# Altium schematic sheet ИУ4.11.03.03.20.63.13.SchDoc
size 420 x 297 mm; PageSetup: Record=PageOptions|CenterHorizontal=True|CenterVertical=True|PrintScale=1.00|XCorrection=1.00|YCorrection=1.00|PrintKind=1|BorderSize=5000000|LeftOffset=0|BottomOffset=0|Orientation=2|PaperLength=1000|PaperWidth=1000|Scale=100|PaperSource=15|PrintQuality=1200|MediaType=1|DitherType=10|PaperKind=A3|PrintScaleMode=1; Weight: -; ScaleFactor: -; Address1: Address1; Address2: Address2; Address3: Address3; Address4: Address4; DocumentNumber: АБВГ.123456.001 Э3; SheetNumber: 1; Scale: 1:1; DocumentType: Схема электрическая принципиальная; FirstReferrence: АБВГ.123456.001
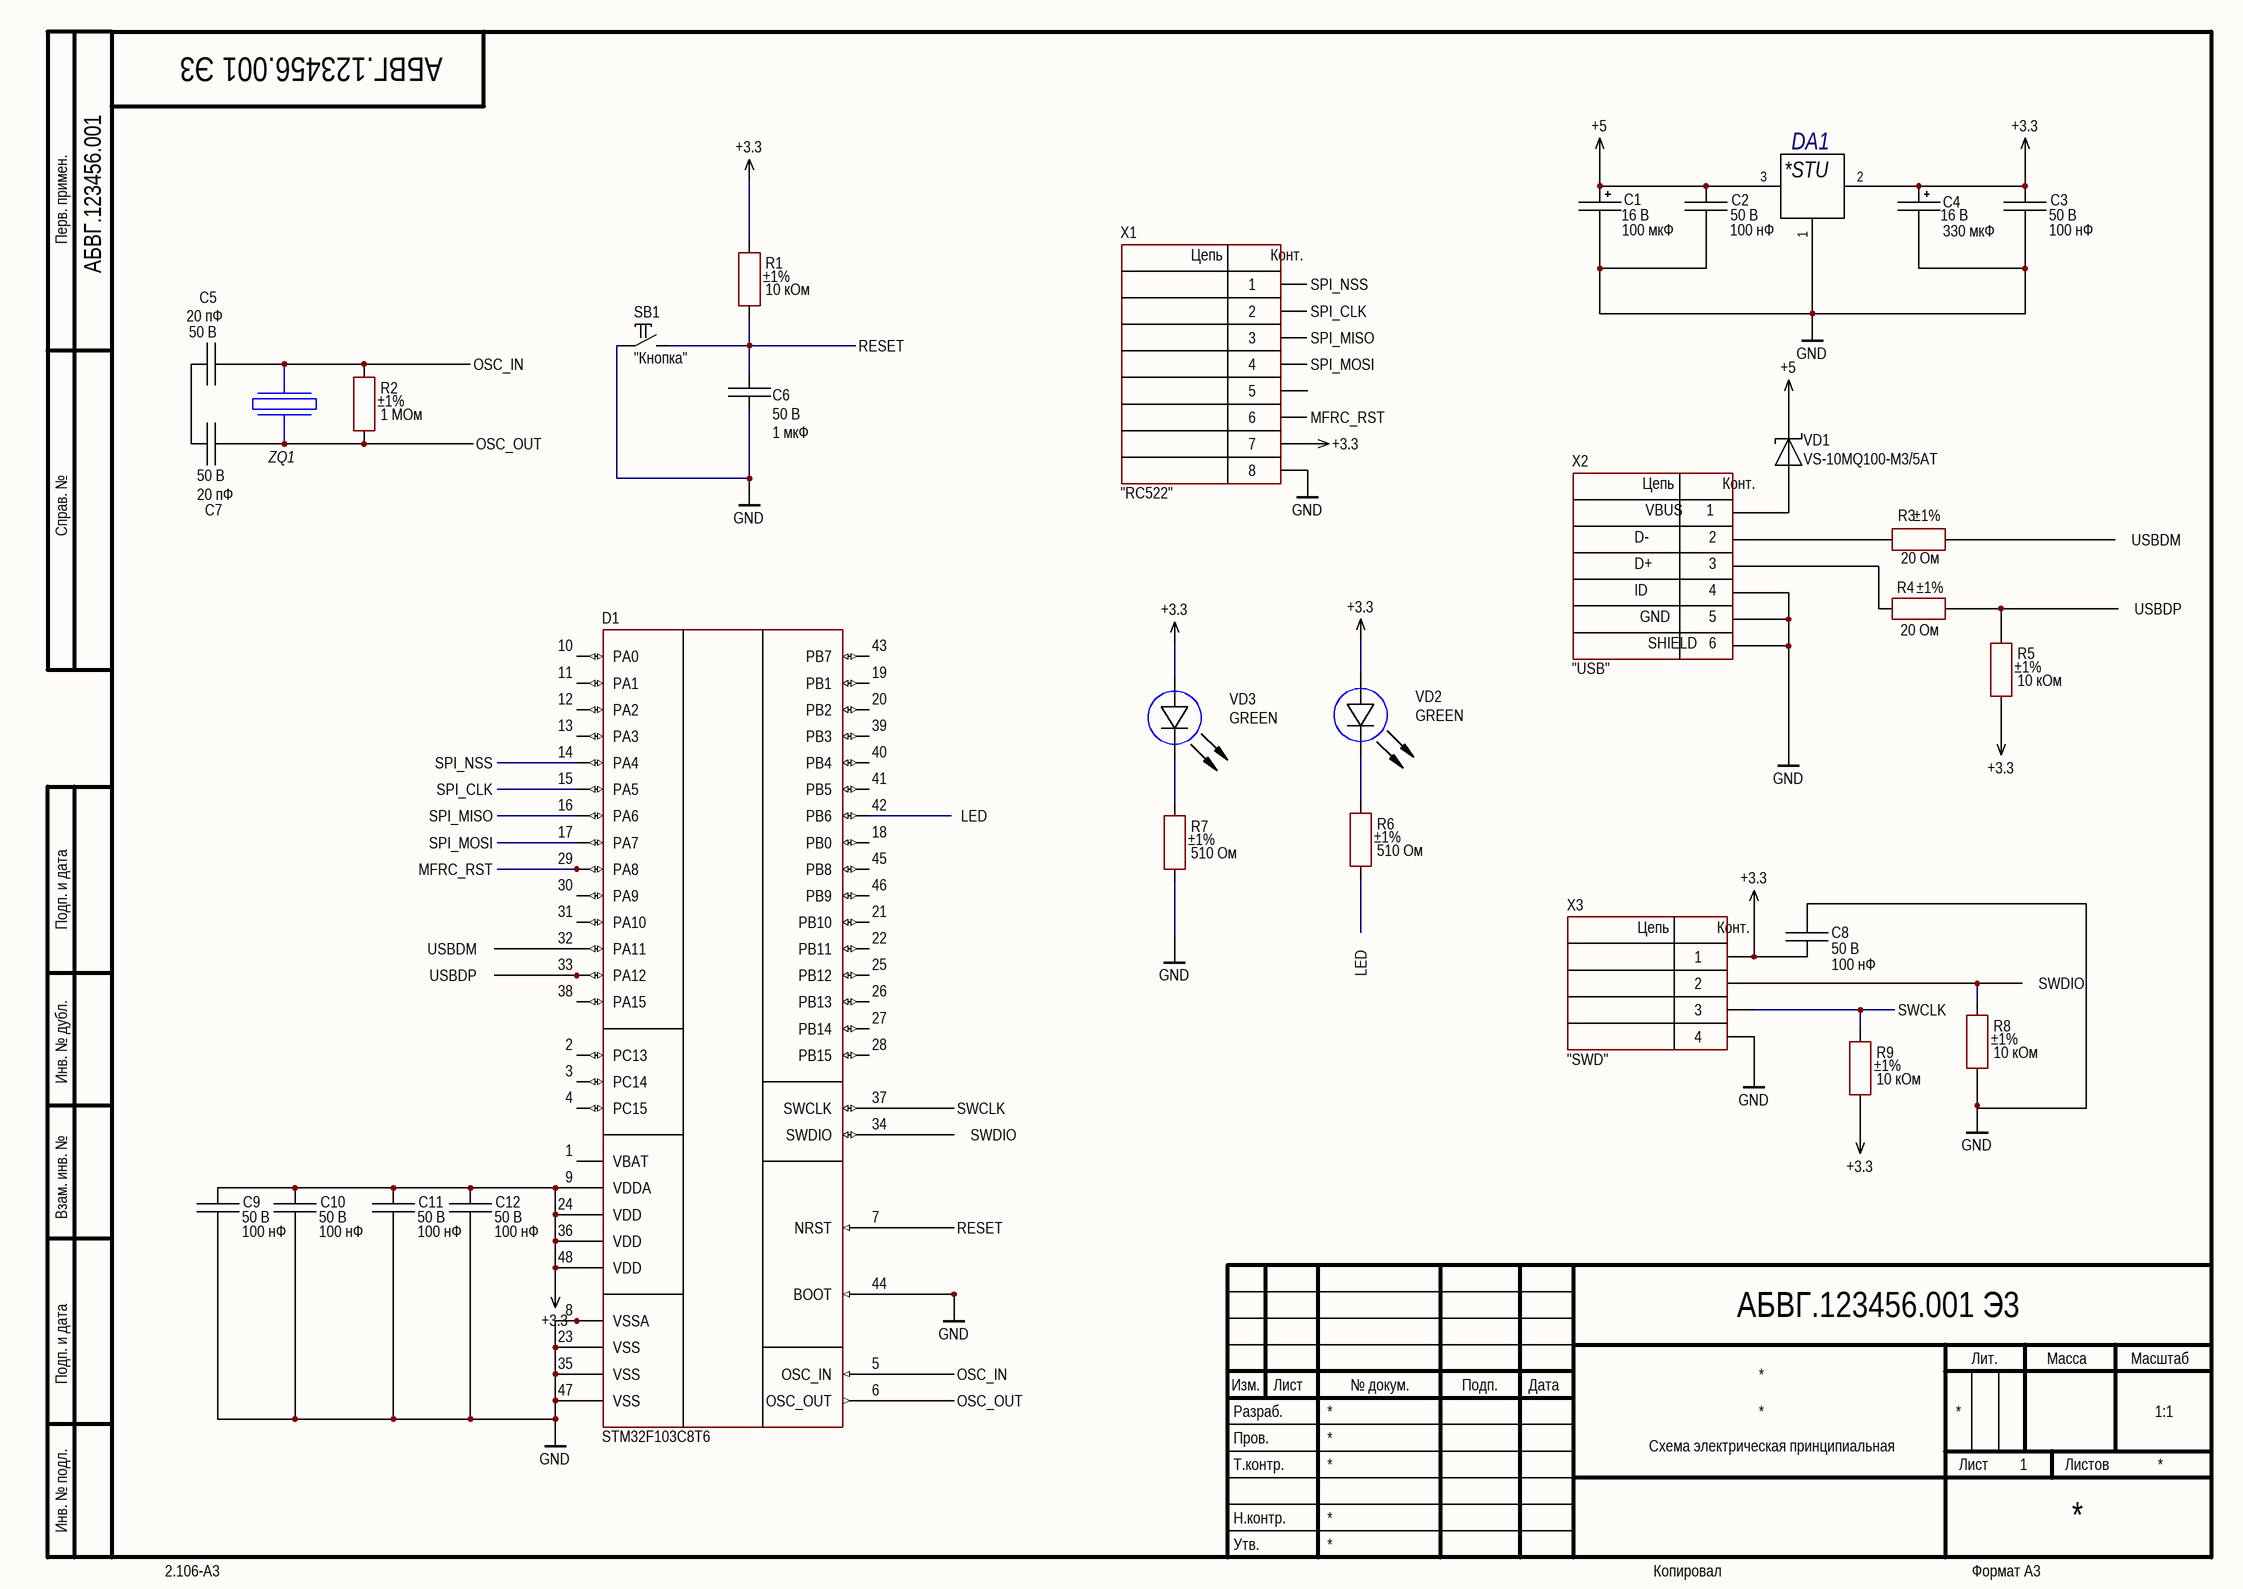
[diagram p0: ИУ4.11.03.03.20.63.13.SchDoc]

## Parts
C1  value 100 мкФ  Voltage: 16 В  [CAP: TANTAL-D]
C2  value 100 нФ  Voltage: 50 В  [CAP: 0805]
C3  value 100 нФ  Voltage: 50 В  [CAP: 0805]
C4  value 330 мкФ  Voltage: 16 В  [CAP: D8C3.5H12]
C5  value 20 пФ  Voltage: 50 В  [CAP: 0805]
C6  value 1 мкФ  Voltage: 50 В  [CAP: 0805]
C7  value 20 пФ  Voltage: 50 В  [CAP: 0805]
C8  value 100 нФ  Voltage: 50 В  [CAP: 0805]
C9  value 100 нФ  Voltage: 50 В  [CAP: 0805]
C10  value 100 нФ  Voltage: 50 В  [CAP: 0805]
C11  value 100 нФ  Voltage: 50 В  [CAP: 0805]
C12  value 100 нФ  Voltage: 50 В  [CAP: 0805]
D1  (no value)  [48-LQFP]
DA1  LM1117-Series  [SOT-223]  (value not drawn)
R1  value 10 кОм  Tolerance: ±1%  [RES: 0805]
R2  value 1 МОм  Tolerance: ±1%  [RES: 0805]
R3  value 20 Ом  Tolerance: ±1%  [RES: 0805]
R4  value 20 Ом  Tolerance: ±1%  [RES: 0805]
R5  value 10 кОм  Tolerance: ±1%  [RES: 0805]
R6  value 510 Ом  Tolerance: ±1%  [RES: 0805]
R7  value 510 Ом  Tolerance: ±1%  [RES: 0805]
R8  value 10 кОм  Tolerance: ±1%  [RES: 0805]
R9  value 10 кОм  Tolerance: ±1%  [RES: 0805]
SB1  CommentText: "Кнопка"  [BUT: 6x6 SMD]
VD1  PartNumber: VS-10MQ100-M3/5AT  [DIODE: SMA]
VD2  Color: GREEN  [LED: 1206R]
VD3  Color: GREEN  [LED: 1206R]
X1  CommentText: "RC522"  [CON: PLS-8]
X2  CommentText: "USB"  [CON: USB micro-A (ZX62-B-5PA)]
X3  CommentText: "SWD"  [CON: PLS-4]
ZQ1  Crystal  [HC-49SM]  (value not drawn)

## Ports
LED (bidir), MFRC_RST, OSC_IN, OSC_OUT, RESET, SPI_CLK, SPI_MISO, SPI_MOSI, SPI_NSS, SWCLK, SWDIO (bidir), USBDM (bidir), USBDP (bidir)

## Nets
+3.3: C3.2 C4.1 C8.1 C9.2 C10.2 C11.2 C12.2 D1.9(VDDA) D1.24(VDD) D1.36(VDD) D1.48(VDD) DA1.2(Out) R1.2 R5.1 R9.1 VD2.1(A) VD3.1(A) X1.7 X3.1
+5: C1.1 C2.2 DA1.3(In) VD1.2
GND: C1.2 C2.1 C3.1 C4.2 C6.1 C8.2 C9.1 C10.1 C11.1 C12.1 D1.8(VSSA) D1.23(VSS) D1.35(VSS) D1.44(BOOT) D1.47(VSS) DA1.1(Adj/GND) R7.1 R8.1 SB1.1 X1.8 X2.0 X2.4 X2.5 X3.4
LED: D1.42(PB6) R6.1 ; port LED
MFRC_RST: D1.29(PA8) X1.6 ; port MFRC_RST
OSC_IN: C5.1 D1.5(OSC_IN) R2.2 ZQ1.3 ; port OSC_IN
OSC_OUT: C7.1 D1.6(OSC_OUT) R2.1 ZQ1.1 ; port OSC_OUT
RESET: C6.2 D1.7(NRST) R1.1 SB1.2 ; port RESET
SPI_CLK: D1.15(PA5) X1.2 ; port SPI_CLK
SPI_MISO: D1.16(PA6) X1.3 ; port SPI_MISO
SPI_MOSI: D1.17(PA7) X1.4 ; port SPI_MOSI
SPI_NSS: D1.14(PA4) X1.1 ; port SPI_NSS
SWCLK: D1.37(SWCLK) R9.2 X3.3 ; port SWCLK
SWDIO: D1.34(SWDIO) R8.2 X3.2 ; port SWDIO
USBDM: D1.32(PA11) R3.2 ; port USBDM
USBDP: D1.33(PA12) R4.2 R5.2 ; port USBDP
NetC5_2: C5.2 C7.2
NetR3_1: R3.1 X2.2
NetR4_1: R4.1 X2.3
NetR6_2: R6.2 VD2.2(C)
NetR7_2: R7.2 VD3.2(C)
NetVD1_1: VD1.1 X2.1

Not connected (* = marked no-connect by the designer): D1 1(VBAT) 2(PC13) 3(PC14) 4(PC15) 10(PA0) 11(PA1) 12(PA2) 13(PA3) 18(PB0) 19(PB1) 20(PB2) 21(PB10) 22(PB11) 25(PB12) 26(PB13) 27(PB14) 28(PB15) 30(PA9) 31(PA10) 38(PA15) 39(PB3) 40(PB4) 41(PB5) 43(PB7) 45(PB8) 46(PB9); X1 5

## Notes on the sheet
- Перв. примен.
- Справ. №
- Подп. и дата
- Инв. № дубл.
- Взам. инв. №
- Разраб.
- Изм.
- Лист
- № докум.
- Подп.
- Дата
- Лит.
- Масса
- Масштаб
- Пров.
- Т.контр.
- Листов
- Инв. № подл.
- Утв.
- Н.контр.
- 2.106-A3
- Копировал
- Формат А3
- (in symbol Connector_USB_micro_B) Цепь; Конт.; VBUS; D-; D+; ID; GND; SHIELD; 6
- (in symbol LM1117MPX-3.3) *STU
- (in symbol PLS-4) Цепь; Конт.
- (in symbol PLS-8) Цепь; Конт.

## Library data of the parts
C1 = Tantal_D: Manufacturer: AVX; PartNumber: TAJD476M035RNJV; ValueManufacturerPartNumber: Tantalum capacitor, 100 мкФ, 16 В, ±20%, 900mOhm, case D (7343), -55...+125°C; Impedance: 900mOhm; Tolerance: ±20%; TypeDielectric: X7R; TypeCapacitor: Tantalum capacitor; Package: case D (7343); HelpURL: https://www.digikey.com/product-detail/en/avx-corporation/TAJD476M035RNJV/478-12122-1-ND/8605695; Temperature: -55...+125°C
C2 C3 C8-C12 = Ceramic_0805: Manufacturer: Yageo; PartNumber: CC0805KRX7R7BB104; ValueManufacturerPartNumber: Ceramic capacitor, 100 нФ, X7R, ±10%, 50 В, 0805, -55...+125°C; TypeCapacitor: Ceramic capacitor; Tolerance: ±10%; TypeDielectric: X7R; Package: 0805; HelpURL: https://www.digikey.com/product-detail/en/yageo/CC0805KRX7R7BB104/311-1142-1-ND/303052; Temperature: -55...+125°C
C4 = Aluminium: Manufacturer: Wurth; PartNumber: 860080475013; ValueManufacturerPartNumber: Aluminium capacitor, 330 мкФ, 16 В, ±20%, 54mOhm, 14x10x5 mm, -55...+105°C; TypeCapacitor: Aluminium capacitor; Tolerance: ±20%; Impedance: 54mOhm; Package: 14x10x5 mm; HelpURL: https://www.digikey.com/product-detail/en/wurth-electronics-inc/860080475013/732-9029-1-ND/5728972; Temperature: -55...+105°C
C5 C7 = Ceramic_0805: Manufacturer: Yageo; PartNumber: CC0805KRX7R7BB104; ValueManufacturerPartNumber: Ceramic capacitor, 20 пФ, X7R, ±10%, 50 В, 0805, -55...+125°C; TypeCapacitor: Ceramic capacitor; Tolerance: ±10%; TypeDielectric: X7R; Package: 0805; HelpURL: https://www.digikey.com/product-detail/en/yageo/CC0805KRX7R7BB104/311-1142-1-ND/303052; Temperature: -55...+125°C
C6 = Ceramic_0805: Manufacturer: Yageo; PartNumber: CC0805KRX7R7BB104; ValueManufacturerPartNumber: Ceramic capacitor, 1 мкФ, X7R, ±10%, 50 В, 0805, -55...+125°C; TypeCapacitor: Ceramic capacitor; Tolerance: ±10%; TypeDielectric: X7R; Package: 0805; HelpURL: https://www.digikey.com/product-detail/en/yageo/CC0805KRX7R7BB104/311-1142-1-ND/303052; Temperature: -55...+125°C
D1 = STM32F103C8T6: Cortex-M3; Manufacturer: STMicroelectronics; ValueManufacturerPartNumber: IC microcontroller, 32-Bit, Cortex-M3, 72MHz, 64KB, 20KB, 2...3.6V, -40...+85°C, 48-LQFP; Supply: 2...3.6V; Speed: 72MHz; CoreSize: 32-Bit; MemoryROM: 64KB; MemoryRAM: 20KB; HelpURL: https://www.digikey.com/product-detail/en/stmicroelectronics/STM32F103C8T6TR/497-17666-1-ND/7804402; Package: 48-LQFP; ComponentType: IC microcontroller; Temperature: -40...+85°C; CoreProcessor: Cortex-M3; PartNumber: STM32F103C8T6
DA1 = LM1117MPX-3.3: ID: 9; Input Voltage: +8.5…20V; Output Current: 800mA; Output Voltage: +3.3V; Published: 13.08.2015; Publisher: Andrew Danich; Type: Микросхема; Part Number: LM1117MPX-3.3; Value: LM1117MPX-3.3
R1 R5 R8 R9 = Resistor_0805: Manufacturer: Yageo; PartNumber: RC0805JR-07100RL; ValueManufacturerPartNumber: Resistor film, 10 кОм, ±1%, 0805, 0.125W, -55...+125°C; TypeResistor: Resistor film; Power: 0.125W; Package: 0805; HelpURL: https://www.digikey.com/product-detail/en/yageo/RC0805JR-07100RL/311-100ARCT-ND/731185; Temperature: -55...+125°C
R2 = Resistor_0805: Manufacturer: Yageo; PartNumber: RC0805JR-07100RL; ValueManufacturerPartNumber: Resistor film, 1 МОм, ±1%, 0805, 0.125W, -55...+125°C; TypeResistor: Resistor film; Power: 0.125W; Package: 0805; HelpURL: https://www.digikey.com/product-detail/en/yageo/RC0805JR-07100RL/311-100ARCT-ND/731185; Temperature: -55...+125°C
R3 R4 = Resistor_0805: Manufacturer: Yageo; PartNumber: RC0805JR-07100RL; ValueManufacturerPartNumber: Resistor film, 20 Ом, ±1%, 0805, 0.125W, -55...+125°C; TypeResistor: Resistor film; Power: 0.125W; Package: 0805; HelpURL: https://www.digikey.com/product-detail/en/yageo/RC0805JR-07100RL/311-100ARCT-ND/731185; Temperature: -55...+125°C
R6 R7 = Resistor_0805: Manufacturer: Yageo; PartNumber: RC0805JR-07100RL; ValueManufacturerPartNumber: Resistor film, 510 Ом, ±1%, 0805, 0.125W, -55...+125°C; TypeResistor: Resistor film; Power: 0.125W; Package: 0805; HelpURL: https://www.digikey.com/product-detail/en/yageo/RC0805JR-07100RL/311-100ARCT-ND/731185; Temperature: -55...+125°C
SB1 = Button_tactile: Manufacturer: TE Connectivity; ValueManufacturerPartNumber: Tactile button, 6x6mm; PartNumber: FSM2JSMAATR; TypeButton: Tactile button; HelpURL: https://www.digikey.com/product-detail/en/te-connectivity-alcoswitch-switches/FSM2JSMAATR/450-1792-1-ND/3503931; Package: 6x6mm
VD1 = Schottky_single: Manufacturer: Diodes Incorporated; ValueManufacturerPartNumber: Schottky diode, 80V, 500mA, 1V, 15pF, SOD-123, -55...+150°C; TypeDiode: Schottky diode; Voltage: 80V; Current: 500mA; VoltageDrop: 1V; RecoveryTime: 15pF; Package: SOD-123; HelpURL: https://www.digikey.com/product-detail/en/diodes-incorporated/MBR0580S1-7/MBR0580S1-7DICT-ND/5080371; Temperature: -55...+150°C
VD2 VD3 = LED_single: ValueManufacturerPartNumber: LED, Green, *, *, *, -55...+150°C; TypeDiode: LED; Manufacturer: *; Package: *; HelpURL: *; Temperature: -55...+150°C; Current: *; VoltageDrop: *; PartNumber: *; ColorParameter: Green
X1 = PLS-8: Manufacturer: Connfly; ValueManufacturerPartNumber: Connector, 8pin, 2.54mm, 500VAC, 3A; TypeConnector: Connector; VoltageMax: 500VAC; Pitch: 2.54mm; CurrentMax: 3A; Multichannel: 8pin; HelpURL: https://www.chipdip.ru/product/pls-8-ds1021-1-8sf112; PartNumber: PLS-8
X2 = Connector_USB_micro_B: Manufacturer: Hirose Electric; ValueManufacturerPartNumber: USB micro B; PartNumber: ZX62-B-5PA; HelpURL: https://www.digikey.com/product-detail/en/hirose-electric-co-ltd/ZX62-B-5PA/H11579CT-ND/1851090; TypeConnector: USB micro B
X3 = PLS-4: Manufacturer: Connfly; ValueManufacturerPartNumber: Connector, 4pin, 2.54mm, 500VAC, 3A; TypeConnector: Connector; VoltageMax: 500VAC; Pitch: 2.54mm; CurrentMax: 3A; Multichannel: 4pin; HelpURL: https://www.chipdip.ru/product/pls-4; PartNumber: PLS-4
ZQ1 = HC49SM-8.000MHz-20pF: ID: 17; Value: HC49S-8.000MHZ-20pF; Output Frequency: 8MHz; Load Capacitance: 20pF; Temperature Coefficient: ±50ppm; Application Category: 1; Published: 08.03.2013; Publisher: Andrew Danich; Type: Резонатор; Part Number: HC49SM-8.000MHz-20pF